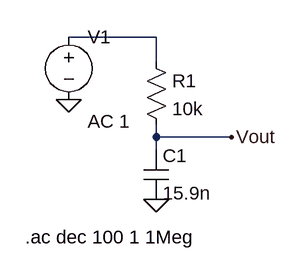
[diagram p0: schematic RC_Low_Pass_Passive.asc]
RC_Low_Pass_Passive.asc, the LTspice schematic file:
Version 4
SHEET 1 880 680
WIRE 64 112 -48 112
WIRE 64 144 64 112
WIRE 64 240 64 224
WIRE 160 240 64 240
WIRE 64 256 64 240
FLAG 64 320 0
FLAG -48 192 0
FLAG 160 240 Vout
SYMBOL res 48 128 R0
SYMATTR InstName R1
SYMATTR Value 10k
SYMBOL cap 48 256 R0
SYMATTR InstName C1
SYMATTR Value 15.9n
SYMBOL voltage -48 96 R0
WINDOW 123 24 124 Left 2
WINDOW 39 0 0 Left 0
SYMATTR InstName V1
SYMATTR Value ""
SYMATTR Value2 AC 1
TEXT -104 368 Left 2 !.ac dec 100 1 1Meg

The netlist it stands for:
* RC_Low_Pass_Passive.asc
R1 N001 Vout 10k
C1 Vout 0 15.9n
V1 N001 0 AC 1
.ac dec 100 1 1Meg
.backanno
.end

* Results of the author's LTspice run, read from the files saved beside the schematic
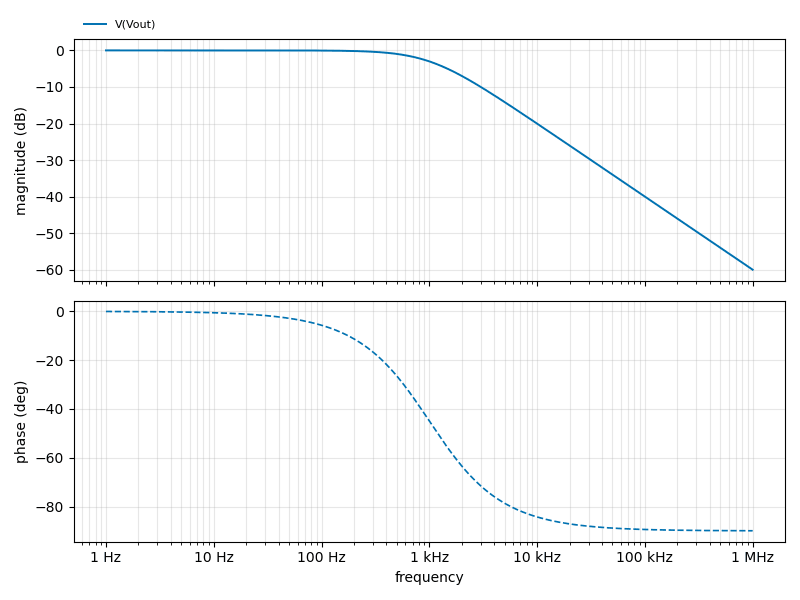
[diagram p1: AC Analysis of RC_Low_Pass_Passive.asc, plotted from the saved traces]
* AC Analysis, 1 run:
*   V(Vout): -0.00 dB at 1 Hz, -59.99 dB at 1 MHz, peak -0.00 dB at 1 Hz, 3 dB below the peak at 1.001 kHz